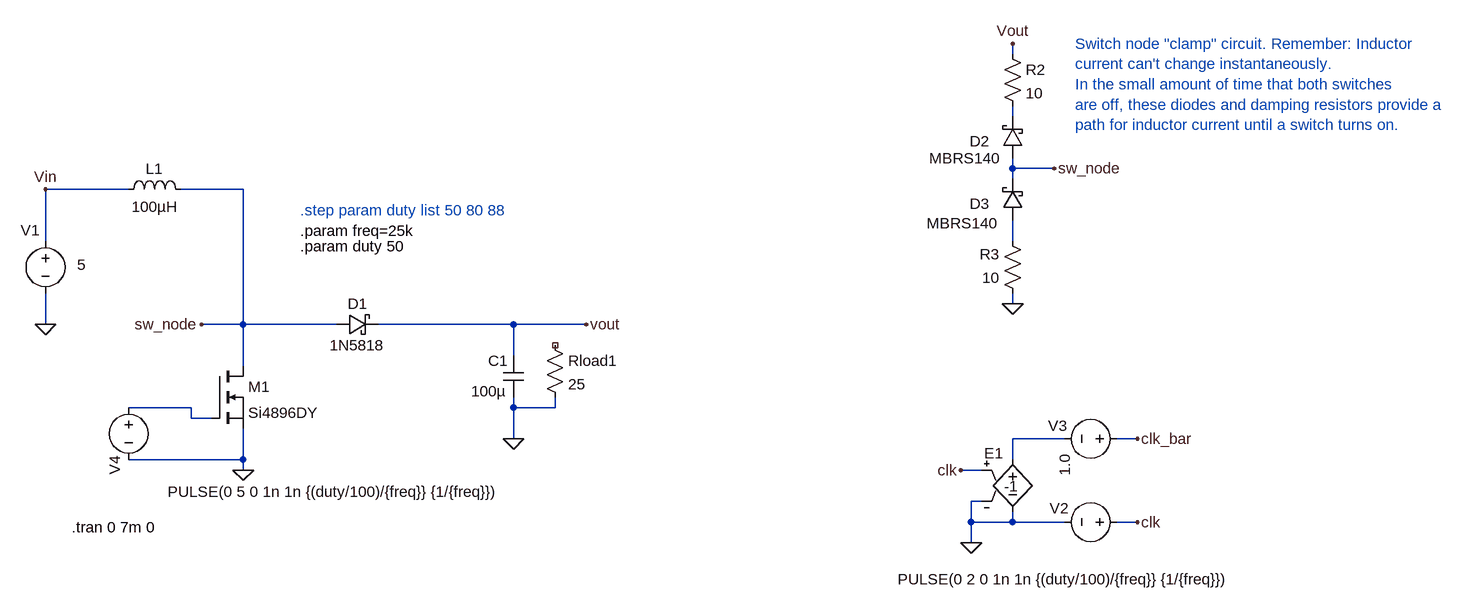
[diagram p0: schematic OL_Boost_concept_nmosfet.asc]
OL_Boost_concept_nmosfet.asc, the LTspice schematic file:
Version 4
SHEET 1 1852 680
WIRE 1136 -304 1136 -320
WIRE 1136 -208 1136 -224
WIRE 1136 -128 1136 -144
WIRE 1200 -128 1136 -128
WIRE 1136 -112 1136 -128
WIRE -224 -96 -352 -96
WIRE -48 -96 -144 -96
WIRE -352 -16 -352 -96
WIRE 1136 -16 1136 -48
WIRE 1136 80 1136 64
WIRE -352 112 -352 64
WIRE -48 112 -48 -96
WIRE -48 112 -112 112
WIRE 96 112 -48 112
WIRE 368 112 160 112
WIRE 480 112 368 112
WIRE 368 160 368 112
WIRE -48 176 -48 112
WIRE -128 240 -224 240
WIRE 368 240 368 224
WIRE 432 240 432 224
WIRE 432 240 368 240
WIRE -128 256 -128 240
WIRE -96 256 -128 256
WIRE 368 288 368 240
WIRE 1216 288 1136 288
WIRE 1328 288 1296 288
WIRE -48 320 -48 272
WIRE -48 320 -224 320
WIRE 1136 320 1136 288
WIRE -48 336 -48 320
WIRE 1088 336 1056 336
WIRE 1088 384 1072 384
WIRE 1072 416 1072 384
WIRE 1136 416 1136 400
WIRE 1136 416 1072 416
WIRE 1216 416 1136 416
WIRE 1328 416 1296 416
WIRE 1072 448 1072 416
FLAG -352 112 0
FLAG -352 -96 Vin
FLAG 368 288 0
FLAG 480 112 vout
FLAG 1328 416 clk
FLAG 1072 448 0
FLAG 1056 336 clk
FLAG 1328 288 clk_bar
FLAG 1136 -320 Vout
FLAG 1136 80 0
FLAG 1200 -128 sw_node
FLAG -112 112 sw_node
FLAG -48 336 0
SYMBOL voltage -352 -32 R0
WINDOW 123 0 0 Left 2
WINDOW 39 0 0 Left 2
WINDOW 0 -38 -1 Left 2
WINDOW 3 49 52 Left 2
SYMATTR InstName V1
SYMATTR Value 5
SYMBOL cap 352 160 R0
WINDOW 0 -23 8 Left 2
WINDOW 3 -49 55 Left 2
SYMATTR InstName C1
SYMATTR Value 100µ
SYMBOL res 416 128 R0
SYMATTR InstName Rload1
SYMATTR Value 25
SYMBOL ind -240 -80 R270
WINDOW 0 32 56 VTop 2
WINDOW 3 5 56 VBottom 2
SYMATTR InstName L1
SYMATTR Value 100µH
SYMBOL voltage 1312 416 R90
WINDOW 123 0 0 Left 2
WINDOW 39 0 0 Left 2
WINDOW 3 88 -163 VRight 2
WINDOW 0 -21 90 VRight 2
SYMATTR Value PULSE(0 2 0 1n 1n {(duty/100)/{freq}} {1/{freq}})
SYMATTR InstName V2
SYMBOL e 1136 304 R0
WINDOW 0 -44 6 Left 2
WINDOW 3 -13 57 Left 2
SYMATTR InstName E1
SYMATTR Value -1
SYMBOL voltage 1312 288 R90
WINDOW 123 0 0 Left 2
WINDOW 39 0 0 Left 2
WINDOW 0 -20 92 VRight 2
SYMATTR InstName V3
SYMATTR Value 1.0
SYMBOL schottky 96 128 R270
WINDOW 0 32 32 VTop 2
WINDOW 3 0 32 VBottom 2
SYMATTR InstName D1
SYMATTR Value 1N5818
SYMATTR Description Diode
SYMATTR Type diode
SYMBOL schottky 1152 -144 R180
WINDOW 0 51 26 Left 2
WINDOW 3 35 0 Left 2
SYMATTR InstName D2
SYMATTR Value MBRS140
SYMATTR Description Diode
SYMATTR Type diode
SYMBOL res 1120 -320 R0
SYMATTR InstName R2
SYMATTR Value 10
SYMBOL res 1152 80 R180
WINDOW 0 36 76 Left 2
WINDOW 3 36 40 Left 2
SYMATTR InstName R3
SYMATTR Value 10
SYMBOL schottky 1152 -48 R180
WINDOW 0 51 26 Left 2
WINDOW 3 39 -4 Left 2
SYMATTR InstName D3
SYMATTR Value MBRS140
SYMATTR Description Diode
SYMATTR Type diode
SYMBOL voltage -224 224 R0
WINDOW 123 0 0 Left 2
WINDOW 39 0 0 Left 2
WINDOW 3 576 145 Right 2
WINDOW 0 -21 90 VRight 2
SYMATTR Value PULSE(0 5 0 1n 1n {(duty/100)/{freq}} {1/{freq}})
SYMATTR InstName V4
SYMBOL nmos -96 176 R0
SYMATTR InstName M1
SYMATTR Value Si4896DY
TEXT 40 -64 Left 2 ;.step param duty list 50 80 88
TEXT 40 -32 Left 2 !.param freq=25k
TEXT -312 424 Left 2 !.tran 0 7m 0
TEXT 1232 -320 Left 2 ;Switch node "clamp" circuit. Remember: Inductor\ncurrent can't change instantaneously.\nIn the small amount of time that both switches\nare off, these diodes and damping resistors provide a\npath for inductor current until a switch turns on.
TEXT 40 -8 Left 2 !.param duty 50

The netlist it stands for:
* OL_Boost_concept_nmosfet.asc
V1 Vin 0 5
C1 vout 0 100µ
Rload1 NC_01 0 25
L1 Vin sw_node 100µH
V2 clk 0 PULSE(0 2 0 1n 1n {(duty/100)/{freq}} {1/{freq}})
E1 N004 0 clk 0 -1
V3 clk_bar N004 1.0
D1 sw_node vout 1N5818
D2 sw_node N001 MBRS140
R2 vout N001 10
R3 0 N002 10
D3 N002 sw_node MBRS140
V4 N003 0 PULSE(0 5 0 1n 1n {(duty/100)/{freq}} {1/{freq}})
M1 sw_node N003 0 0 Si4896DY
.model D D
.lib standard.dio
.model NMOS NMOS
.model PMOS PMOS
.lib standard.mos
* .step param duty list 50 80 88
.param freq=25k
.tran 0 7m 0
* Switch node "clamp" circuit. Remember: Inductor
* current can't change instantaneously.
* In the small amount of time that both switches
* are off, these diodes and damping resistors provide a
* path for inductor current until a switch turns on.
.param duty 50
.backanno
.end